# EAGLE design mini layout (EAGLE 5.11)
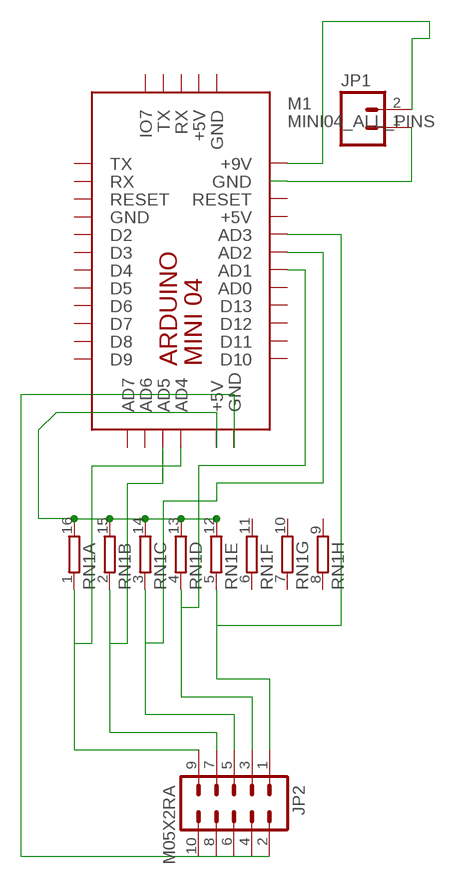
[diagram p0: schematic, sheet 1]

## Parts
JP1  M02LOCK  [1X02_LOCK]
JP2  M05X2RA  [2X5-RA]
M1  MINI04_ALL_PINS  [MINI04_ALL_PINS]
RN1  8R-N  [DIL16]

## Nets
N$1: JP1.1 M1.GND@2(GND)
N$2: JP2.2 JP2.10 M1.GND@3(GND)
N$3: JP2.9 M1.AD4 RN1.1
N$4: JP2.7 M1.AD5 RN1.2
N$6: JP2.3 M1.AD2 RN1.4
N$7: JP2.1 M1.AD3 RN1.5
N$8: JP2.5 M1.AD1 RN1.3
N$9: JP1.2 M1.+9V
N$10: M1.+5V@2(+5V) RN1.12 RN1.13 RN1.14 RN1.15 RN1.16
Unconnected: JP2.4 JP2.6 JP2.8 M1.AD0 M1.AD6 M1.AD7 M1.D2 M1.D3 M1.D4 M1.D5 M1.D6 M1.D7 M1.D8 M1.D9 M1.D10 M1.D11 M1.D12 M1.D13 M1.IO7 M1.RESET@1(RESET) M1.RESET@2(RESET) M1.RX@1(RX) M1.RX@2(RX) M1.TX@1(TX) M1.TX@2(TX) RN1.6 RN1.7 RN1.8 RN1.9 RN1.10 RN1.11

## Power pins joined to a net without a drawn wire
+5V: M1.+5V@1(+5V) M1.+5V@3(+5V)
GND: M1.GND@1(GND) M1.GND@4(GND)

## Library data of the parts
JP1 = SparkFun:M02: Header 2 Standard 2-pin 0.1" header. Use with straight break away headers (SKU : PRT-00116), right angle break away headers (PRT-00553), swiss pins (PRT-00743), machine pins (PRT-00117), and female headers (PRT-00115). Molex polarized connector foot print use with SKU : PRT-08233 with associated crimp pins and housings.
JP2 = SparkFun:M05X2: Header 5x2 Standard 10-pin dual row 0.1" header. Commonly used with AVR-ISP. Use with Spark Fun Electronics SKU: PRT-00778
M1 = arduino:MINI04_ALL_PINS
RN1 = resistor-dil:8R-N: DIL RESISTOR; OC_FARNELL: unknown; OC_NEWARK: unknown

## Board
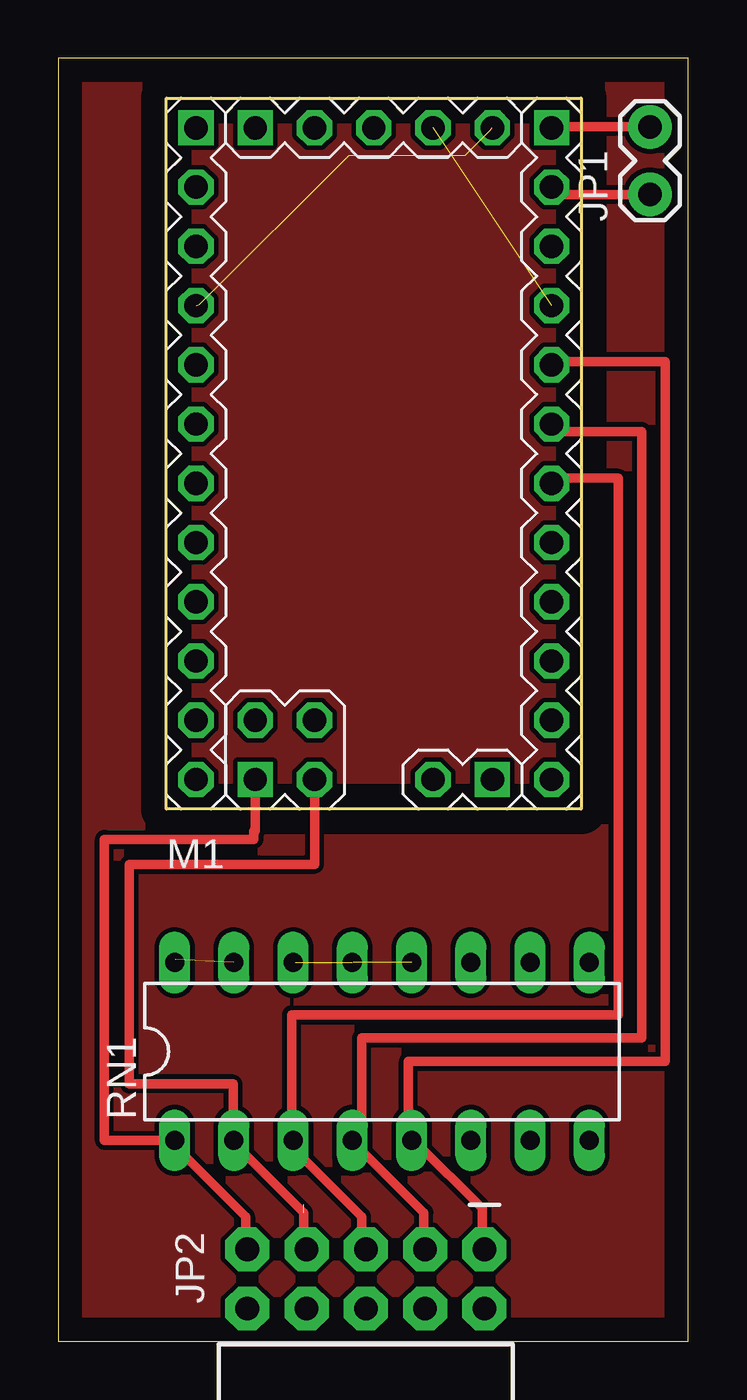
[diagram p1: board, top side]
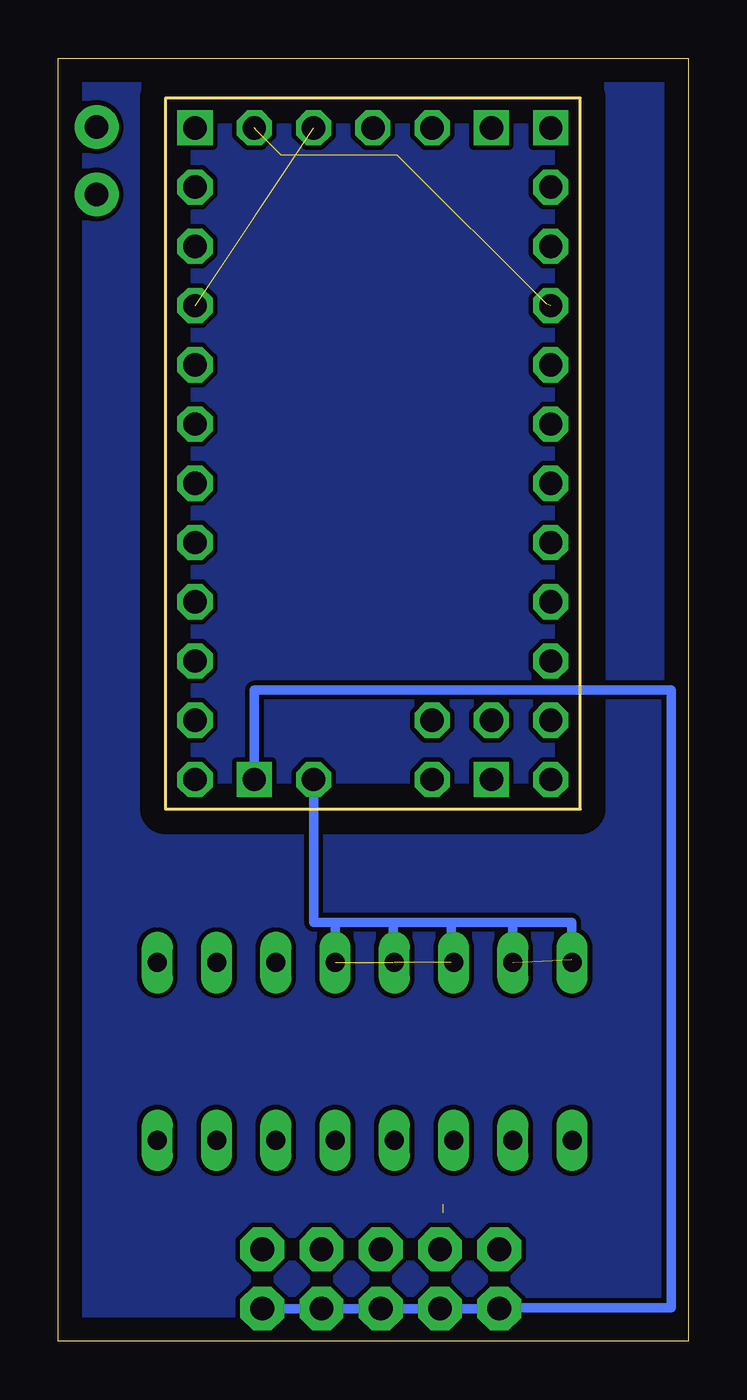
[diagram p2: board, bottom side, seen from below]

Size 27 x 55 mm. Coordinates in mm from the lower left corner, seen from the top.
Outline: 0,0 27,0 27,55 0,55 0,0
Copper layers (1*16): Top 0.035mm / dielectric 1.5mm / Bottom 0.035mm
Design rules "default": minimum track width 10mil, minimum drill 24mil, track to track 8mil, track to pad 8mil, pad to pad 8mil, via to via 8mil, smd to smd 8mil, copper to edge 40mil, drill to drill 8mil, minimum pad ring 10mil, minimum via ring 8mil, stop-mask expansion 4mil, vias tented up to drill 0mil, thermal gap 10mil

### Footprints (pad centres in the part's own frame; a part is rotated, then mirrored left to right if it is on the bottom)
1X02_LOCK = drill 1.016 pad 1.88 round: 1 -0.178,0; 2 2.718,0
2X5-RA = drill 1.016 pad 1.88 octagon: 1 -1.27,5.08; 2 1.27,5.08; 3 -1.27,2.54; 4 1.27,2.54; 5 -1.27,0; 6 1.27,0; 7 -1.27,-2.54; 8 1.27,-2.54; 9 -1.27,-5.08; 10 1.27,-5.08
MINI04_ALL_PINS = drill 1 octagon: +5V@1 10.16,0; +5V@2 5.08,-20.32; +5V@3 5.08,7.62; AD0 10.16,-10.16; AD1 10.16,-7.62; AD2 10.16,-5.08; AD3 10.16,-2.54; AD5 0,-20.32; AD6 -2.54,-17.78; AD7 0,-17.78; D2 -5.08,-2.54; D3 -5.08,-5.08; D4 -5.08,-7.62; D5 -5.08,-10.16; D6 -5.08,-12.7; D7 -5.08,-15.24; D8 -5.08,-17.78; D9 -5.08,-20.32; D10 10.16,-20.32; D11 10.16,-17.78; D12 10.16,-15.24; D13 10.16,-12.7; GND@1 -5.08,0; GND@2 10.16,5.08; GND@4 7.62,7.62; RESET@1 -5.08,2.54; RESET@2 10.16,2.54; RX@1 -5.08,5.08; RX@2 2.54,7.62; TX@2 0,7.62 | drill 1 square: +9V 10.16,7.62; AD4 -2.54,-20.32; GND@3 7.62,-20.32; IO7 -2.54,7.62; TX@1 -5.08,7.62
DIL16 = drill 0.813 long: 1 -8.89,-3.81; 2 -6.35,-3.81; 3 -3.81,-3.81; 4 -1.27,-3.81; 5 1.27,-3.81; 6 3.81,-3.81; 7 6.35,-3.81; 8 8.89,-3.81; 9 8.89,3.81; 10 6.35,3.81; 11 3.81,3.81; 12 1.27,3.81; 13 -1.27,3.81; 14 -3.81,3.81; 15 -6.35,3.81; 16 -8.89,3.81

### Placement (x,y rotation side)
JP1  25.36,49.34 90 top
JP2  13.18,2.67 270 top
M1  10.98,44.4 0 top
RN1  13.87,12.42 0 top

### Tracks (layer width: path | path; a pad name or v marks a point on that pad's centre or on a via)
+5V  (1 unrouted)
GND  (5 unrouted)
N$1
  Top 0.406: JP1.1 21.14,49.16 M1.GND@2
N$2
  Bottom 0.254: 8.02,1.42 JP2.10 | JP2.2 18.34,1.42
  Bottom 0.406: M1.GND@3 18.6,27.56 18.6,27.91 0.73,27.91 0.73,1.42 8.02,1.42 | JP2.10 JP2.2
N$3
  Top 0.254: RN1.1 5,8.53 | JP2.9 8.02,4.09
  Top 0.406: RN1.1 1.98,8.61 1.98,21.51 8.38,21.51 8.38,21.87 8.44,21.87 M1.AD4 | 5,8.53 5,8.36 8.02,5.33 8.02,4.02 JP2.9
N$4  (1 unrouted)
  Top 0.254: 7.67,8.53 RN1.2 | JP2.7 10.51,4.09
  Top 0.406: RN1.2 7.49,8.61 7.49,11.02 3.04,11.02 3.04,20.45 10.98,20.45 M1.AD5 | 7.67,8.53 7.85,8.53 7.85,8.18 10.51,5.51 10.51,4.07 JP2.7
N$5
  pour Top: 0,55 27,55 27,0 0,0
N$6
  Top 0.254: 12.65,8.53 RN1.4 | JP2.3 15.67,4.09
  Top 0.406: RN1.4 13,8.61 13,13 25,13 25,39 21.14,39 M1.AD2 | 12.65,8.53 15.67,5.51 15.67,3.99 JP2.3
N$7
  Top 0.254: 15.31,8.53 RN1.5 | JP2.1 18.16,4.09
  Top 0.406: RN1.5 15,8.61 15,12 26,12 26,42 21.14,42 M1.AD3 | 15.31,8.53 18.16,5.69 18.16,4.04 JP2.1
N$8
  Top 0.254: JP2.5 13.18,4.09
  Top 0.406: 21.14,36.8 M1.AD1 21.14,37 24,37 24,14 10,14 10,8.61 RN1.3 10.06,8.28 13,5.33 13,4.12 JP2.5
N$9
  Top 0.406: JP1.2 21.14,52.06 M1.+9V
N$10  (3 unrouted)
  Bottom 0.254: RN1.16 5,16.36 | 15.14,16.36 RN1.12
  Bottom 0.406: 15.14,17.96 15.49,17.96 16.06,17.96 M1.+5V@2 | RN1.15 7.52,17.96 | RN1.14 10.16,16.23 10.16,17.96 | RN1.13 12.65,16.23 12.65,17.96 | 15.14,17.96 15.14,16.36 | 5,16.36 5,17.96 15.14,17.96
N$11
  pour Bottom: 0,55 27,55 27,0 0,0